# EAGLE schematic usb-uart (EAGLE 9.6.2)

## Sheet 1 of 4: USB port
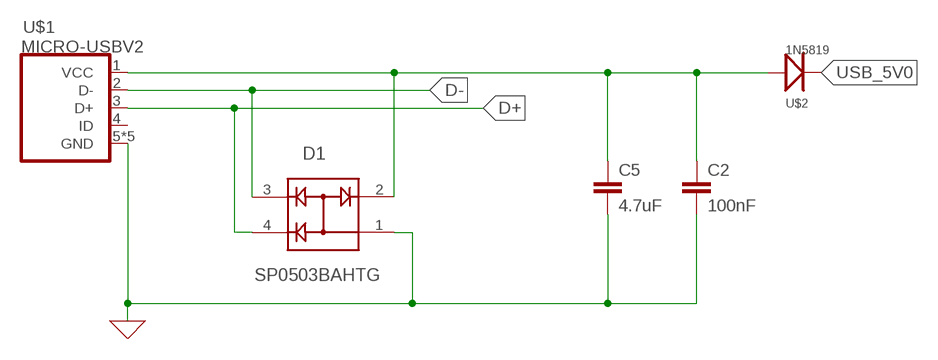
[diagram p0: schematic, sheet 1]

### Parts
C2  100nF  C-EUC0805  [C0805]
C5  4.7uF  C-EUC0805  [C0805]
D1  SP0503BAHTG  [SOT143]
U$1  MICRO-USBV2  [MICRO-USB-2]
U$2  1N5819  [SOD-123]

### Nets
0: C2.2 C5.2 D1.1 U$1.5(GND) U$1.P$1(GND) U$1.P$2(GND) U$1.P$3(GND) U$1.P$4(GND) ; supply symbol labelled GND ; also sheet 2,3
D+: D1.4 U$1.3(D+) ; also sheet 2,3
D-: D1.3 U$1.2(D-) ; also sheet 2,3
USB_5V0: C2.1 C5.1 D1.2 U$1.1(VCC) U$2.A ; also sheet 2,3
Unconnected: U$1.4(ID) U$2.K

## Sheet 2 of 4: CH340C
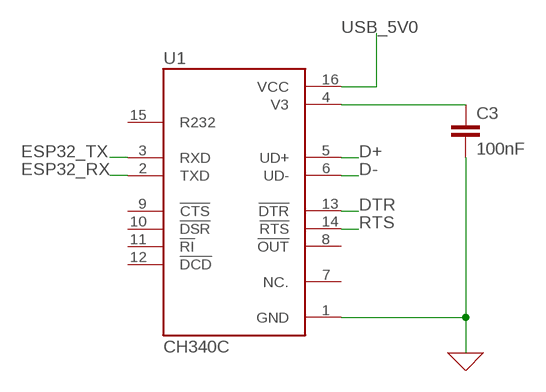
[diagram p1: schematic, sheet 2]

### Parts
C3  100nF  C-EUC0805  [C0805]
U1  CH340C  [SOIC127P600X180-16N]

### Nets
0: C3.2 U1.1(GND) ; supply symbol labelled GND ; also sheet 1,3
D+: U1.5(UD+) ; also sheet 1,3
D-: U1.6(UD-) ; also sheet 1,3
DTR: U1.13(!DTR) ; also sheet 3,4
ESP32_RX: U1.2(TXD) ; also sheet 3
ESP32_TX: U1.3(RXD) ; also sheet 3
N$2: C3.1 U1.4(V3)
RTS: U1.14(!RTS) ; also sheet 3,4
USB_5V0: U1.16(VCC) ; also sheet 1,3
Unconnected: U1.7(NC.) U1.8(!OUT) U1.9(!CTS) U1.10(!DSR) U1.11(!RI) U1.12(!DCD) U1.15(R232)

## Sheet 3 of 4: CP2102
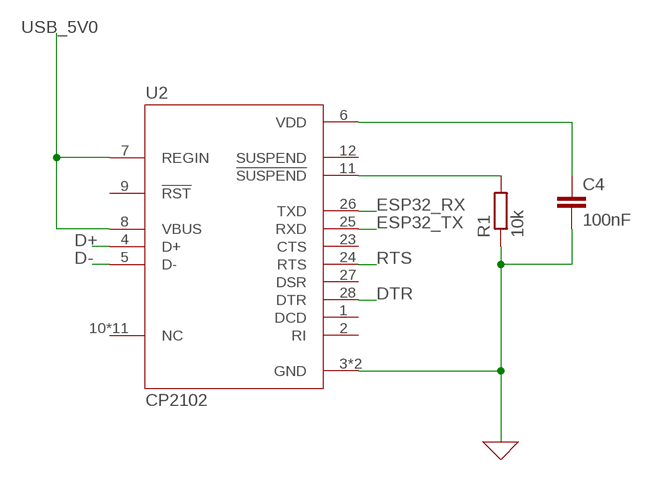
[diagram p2: schematic, sheet 3]

### Parts
C4  100nF  C-EUC0805  [C0805]
R1  10k  R-EU_R0805  [R0805]
U2  CP2102  [QFN50P500X500X100-29N]

### Nets
0: C4.2 R1.1 U2.3(GND) U2.29(GND) ; supply symbol labelled GND ; also sheet 1,2
D+: U2.4(D+) ; also sheet 1,2
D-: U2.5(D-) ; also sheet 1,2
DTR: U2.28(DTR) ; also sheet 2,4
ESP32_RX: U2.26(TXD) ; also sheet 2
ESP32_TX: U2.25(RXD) ; also sheet 2
N$1: R1.2 U2.11(!SUSPEND)
N$3: C4.1 U2.6(VDD)
RTS: U2.24(RTS) ; also sheet 2,4
USB_5V0: U2.7(REGIN) U2.8(VBUS) ; also sheet 1,2
Unconnected: U2.1(DCD) U2.2(RI) U2.9(!RST) U2.10(NC) U2.12(SUSPEND) U2.13(NC) U2.14(NC) U2.15(NC) U2.16(NC) U2.17(NC) U2.18(NC) U2.19(NC) U2.20(NC) U2.21(NC) U2.22(NC) U2.23(CTS) U2.27(DSR)

## Sheet 4 of 4: Auto programmer
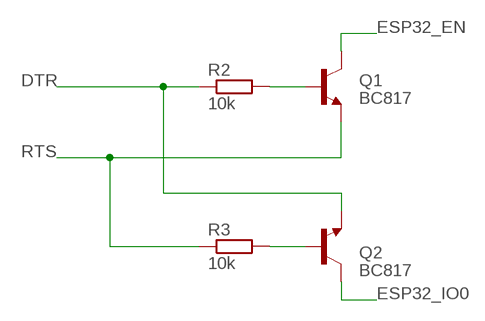
[diagram p3: schematic, sheet 4]

### Parts
Q1  BC817  [SOT95P230X110-3N]
Q2  BC817  [SOT95P230X110-3N]
R2  10k  R-EU_R0805  [R0805]
R3  10k  R-EU_R0805  [R0805]

### Nets
DTR: Q2.2(E) R2.1 ; also sheet 2,3
ESP32_EN: Q1.3(C)
ESP32_IO0: Q2.3(C)
N$4: Q2.1(B) R3.2
N$5: Q1.1(B) R2.2
RTS: Q1.2(E) R3.1 ; also sheet 2,3

## Library data of the parts
C2-C5 = rcl:C-EU: CAPACITOR, European symbol; SPICEPREFIX: C
D1 = SP0503BAHTG:SP0503BAHTG: TVS DIODE 5.5VWM 8.5VC SOT143 Check availability <https://pricing.snapeda.com/parts/SP0503BAHTG/Littelfuse%20Inc./view-part?ref=eda>; AVAILABILITY: In Stock; DESCRIPTION: 8.5V Clamp - Ipp Tvs Diode Surface Mount SOT-143-4; MF: Littelfuse Inc.; MP: SP0503BAHTG; PACKAGE: None; PRICE: None; PURCHASE-URL: https://pricing.snapeda.com/search/part/SP0503BAHTG/?ref=eda
Q1 Q2 = BC817:BC817: Transistor, Npn, 0.5a, 45v, Sot23 Check availability <https://pricing.snapeda.com/parts/BC817/Rectron/view-part?ref=eda>; AVAILABILITY: In Stock; DESCRIPTION: Bipolar (BJT) Transistor NPN 45V 500mA 100MHz 250mW Surface Mount TO-236AB; MF: Rectron; MP: BC817; PACKAGE: SOT-23-3 Rectron; PRICE: None
R1-R3 = rcl:R-EU_: RESISTOR, European symbol; SPICEPREFIX: R
U1 = CH340C:CH340C: USB to serial chip CH340 Check availability <https://pricing.snapeda.com/parts/CH340C/WCH/view-part?ref=eda>; AVAILABILITY: Not in stock; DESCRIPTION: USB to serial chip CH340; MF: WCH; MP: CH340C; PACKAGE: None; PRICE: None
U2 = CP2102:CP2102: USB to UART Bridge Check availability <https://pricing.snapeda.com/parts/CP2102/Silicon%20Labs/view-part?ref=eda>; AVAILABILITY: In Stock; DESCRIPTION: CP2102N USB 2.0 to UART (RS232) Bridge Interface Evaluation Board; MF: Silicon Labs; MP: CP2102; PACKAGE: WFQFN-20 Silicon Labs; PRICE: None; PURCHASE-URL: https://pricing.snapeda.com/search/part/CP2102/?ref=eda
U$1 = microusb:MICRO-USB: Micro USB B connector
U$2 = 1N5819:1N5819: Check availability <https://pricing.snapeda.com/parts/1N5819/STMicroelectronics/view-part?ref=eda>; AVAILABILITY: In Stock; DESCRIPTION: DIODE, SCHOTTKY, 1A, 40V; Diode Type:Schottky; Voltage, Vrrm:40V; Current, If AV:1A; Current, Ifsm:25A; Voltage, Vf Max:0.9V; Temperature, Tj Max:125°C; Termination Type:Axial Leaded; Case Style:DO-41; No. of Pins:2; Current, If ;RoHS Compliant: Yes; MF: STMicroelectronics; MP: 1N5819; PACKAGE: DO-41 Multicomp; PRICE: None; PURCHASE-URL: https://pricing.snapeda.com/search/part/1N5819/?ref=eda